# Altium schematic sheet UPS.SchDoc
size A4
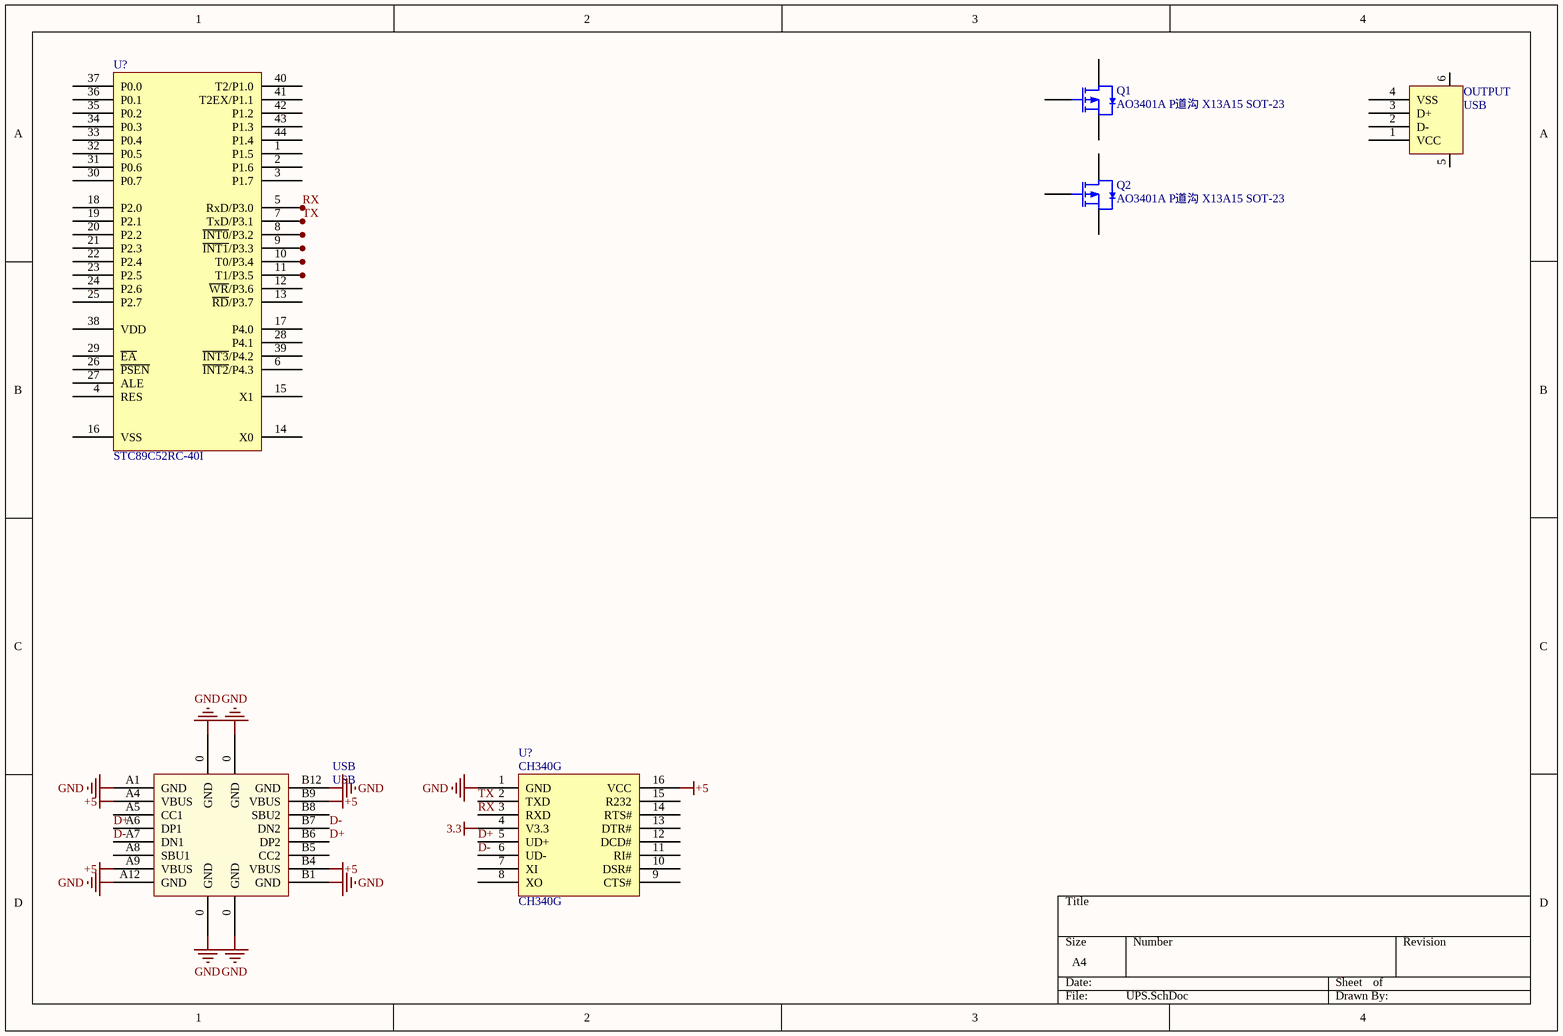
[diagram p0: UPS.SchDoc]

## Parts
(Parts that share a designator on the sheet are numbered #1, #2 ... from top to bottom, then left to right.)
OUTPUT  USB  [USB_A1]
Q1  AO3401A P道沟 X13A15 SOT-23  [SOT-23-3L]
Q2  AO3401A P道沟 X13A15 SOT-23  [SOT-23-3L]
U?#1  STC89C52RC-40I  [LQFP-44_10x10x08P]
U?#2  CH340G  [SOIC-16_150mil]
USB  USB  [USB Type-C 16P]

## Nets
3.3: U?#2.4(V3.3)
+5: U?#2.16(VCC) USB.A4(VBUS) USB.A9(VBUS) USB.B4(VBUS) USB.B9(VBUS)
GND: U?#2.1(GND) USB.0(GND) USB.A1(GND) USB.A12(GND) USB.B1(GND) USB.B12(GND)
D+: U?#2.5(UD+) USB.A6(DP1) USB.B6(DP2)
D-: U?#2.6(UD-) USB.A7(DN1) USB.B7(DN2)
RX: U?#1.5(RxD/P3.0) U?#2.3(RXD)
TX: U?#1.7(TxD/P3.1) U?#2.2(TXD)

Not connected (* = marked no-connect by the designer): OUTPUT 1(VCC) 2(D-) 3(D+) 4(VSS) 5 6; Q1 1(G) 2(S) 3(D); Q2 1(G) 2(S) 3(D); U?#1 1(P1.5) 2(P1.6) 3(P1.7) 4(RES) 6(~{INT2}/P4.3) 8(~{INT0}/P3.2) 9(~{INT1}/P3.3) 10(T0/P3.4) 11(T1/P3.5) 12(~{WR}/P3.6) 13(~{RD}/P3.7) 14(X0) 15(X1) 16(VSS) 17(P4.0) 18(P2.0) 19(P2.1) 20(P2.2) 21(P2.3) 22(P2.4) 23(P2.5) 24(P2.6) 25(P2.7) 26(~{PSEN}) 27(ALE) 28(P4.1) 29(~{EA}) 30(P0.7) 31(P0.6) 32(P0.5) 33(P0.4) 34(P0.3) 35(P0.2) 36(P0.1) 37(P0.0) 38(VDD) 39(~{INT3}/P4.2) 40(T2/P1.0) 41(T2EX/P1.1) 42(P1.2) 43(P1.3) 44(P1.4); U?#2 7(XI) 8(XO) 9(CTS#) 10(DSR#) 11(RI#) 12(DCD#) 13(DTR#) 14(RTS#) 15(R232); USB A5(CC1) A8(SBU1) B5(CC2) B8(SBU2)

## Library data of the parts
OUTPUT = USB: USB接口
Q1 Q2 = AO3401A P道沟 X13A15 SOT-23: MOS(场效应管); ComponentLink1Description: 供应商链接; ComponentLink1URL: http://www.szlcsc.com/product/details_15801.html; Package: SOT-23; Supplier: LC; SuppliersPartNumber: C15127
U?#1 = STC89C52RC-40I: MCU; ComponentLink1Description: 供应商链接; ComponentLink1URL: http://www.szlcsc.com/product/details_9213.html; Package: LQFP-44_10x10x08P; Supplier: LC; SuppliersPartNumber: C8707
U?#2 = CH340G_[C14267]: USB; ComponentLink1Description: 供应商链接; ComponentLink1URL: http://www.szlcsc.com/product/details_14927.html; Package: SOIC-16_150mil; Supplier: LC; SuppliersPartNumber: C14267
USB = USB Type-C 16P: pin to pad: A9>B4 A12>B1 B9>A4 B12>A1